# Altium schematic sheet Verwarmingselement.SchDoc
size A; SheetNumber: 3; SheetTotal: 5
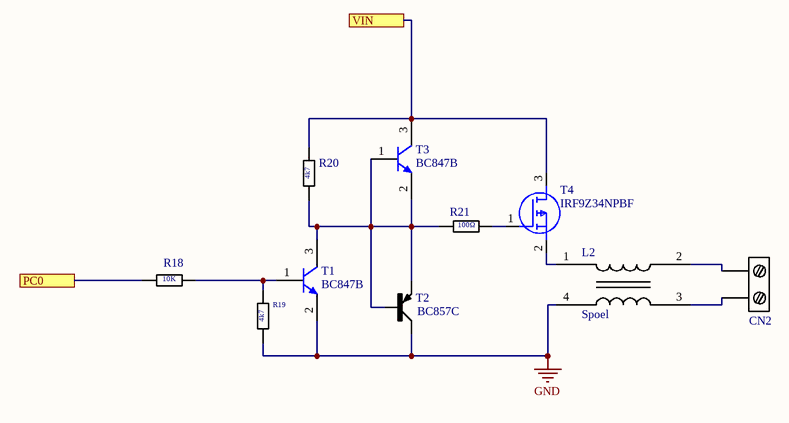
[diagram p0: Verwarmingselement.SchDoc]

## Parts
CN2  (no value)  [K1,K2,K3,K8 Printkroonsteen]
L2  Spoel  [CM2545x171B-10]
R18  10K  [Resistor]
R19  4k7  [Resistor]
R20  4k7  [Resistor]
R21  100Ω  [Resistor]
T1  BC847B  [bc847b]
T2  BC857C  [BC557C]
T3  BC847B  [bc847b]
T4  IRF9Z34NPBF  [TO254P469X1042X1967-3P]

## Ports
PC0 (see Soldeer Station[3A]), VIN (see Batterij[3C])

## Nets
GND: L2.4 R19.1 T1.2(E) T2.C
PC0: R18.1 ; port PC0
VIN: R20.2 T3.3(C) T4.3(D) ; port VIN
NetCN2_1: CN2.1 L2.2
NetCN2_2: CN2.2 L2.3
NetL2_1: L2.1 T4.2(S)
NetR18_2: R18.2 R19.2 T1.1(B)
NetR20_1: R20.1 R21.1 T1.3(C) T2.B T2.E T3.1(B) T3.2(E)
NetR21_2: R21.2 T4.1(G)

## Library data of the parts
CN2 = K1,K2,K3,K8 Printkroonsteen: MF: TE Connectivity; MP: 282837-2; SnapEDA_Link: https://www.snapeda.com/parts/282837-2/TE+Connectivity+AMP+Connectors/view-part/?ref=snap; Price: None; Check_prices: https://www.snapeda.com/parts/282837-2/TE+Connectivity+AMP+Connectors/view-part/?ref=eda; Purchase-URL: https://pricing.snapeda.com/search/part/282837-2/?ref=eda; Value: *; Availability: In Stock; Package: None
L2 = Common Mode Smoorspoel: Lead Diameter: 0.9mm; Voltage Rating (DC): 300V; Current: 700mA; Inductance: 10mH; Lead/Base Style: Pin; DC Resistance (DCR): 100mR; Shielding: Unshielded; Number of Lines: 2; Packaging: Bulk; Max Operating Temperature: 120°C; Depth: 16mm; Width: 0.63inch; Radiation Hardening: No; Max DC Current: 700mA; Package Quantity: 1260; Height: 17.5mm; Current Rating: 700mA; Military Standard: Not; Lead Free: Lead Free; Orientation: Vertical; DC Current: 700mA; Termination: Radial; Insulation Resistance: 100MR; Length: 18mm; Mount: Through Hole; Lead Pitch: 13mm; Min Operating Temperature: -25°C; REACH SVHC: No SVHC
R18-R21 = Resistor: Manufacturer: Vishay Dale; Part Number: CRCW08050000Z0EA
T1 T3 = BC847B: NPN Silicon AF Transistor, 45 V VCEO, 100 mA IC, SOT23, Reel, Green; Manufacturer: Infineon; VEBO (max): 6Â V; ICBO (max): 15Â nA; VCBO (max): 50Â V; IBM (max): 200Â mA; Green: TRUE; Ptot (max): 330Â mW; fT (typ): 250Â MHz; IC (max): 100Â mA; VCEO (max): 45Â V; PackageDescription: 3-Pin Small Outline Transistor Package, 1.3 x 2.9 mm Body, 0.95 mm Pitch; ComponentLink3URL: http://www.infineon.com/dgdl/SOT23-Package_Overview.pdf?folderId=db3a30431936bc4b0119532290053c66&fileId=db3a30431936bc4b0119533468123c85; PackageVersion: Apr-08; Packing: Reel; ComponentLink3Description: Package Specification; ComponentLink2URL: http://www.infineon.com/dgdl/bc847series_bc848series_bc849series_bc850series.pdf?folderId=db3a304314dca389011541d30fa21656&fileId=db3a304314dca389011541d4630a1657; ComponentLink1URL: http://www.infineon.com/; ComponentLink2Description: Datasheet; Polarity: NPN; Mounting Technology: Surface Mount; PackageReference: SOT23; ICM (max): 200Â mA; ComponentLink1Description: Manufacturer URL; PartNumber: BC847B
T2 = BC557C: MP: BC557; MF: ON; Availability: In Stock; Package: E-PKG AXIAL-LEADED-2 ON Semiconductor; Value: *; Check_prices: https://www.snapeda.com/parts/BC557/Onsemi/view-part/?ref=eda; SnapEDA_Link: https://www.snapeda.com/parts/BC557/Onsemi/view-part/?ref=snap; Price: None
T4 = IRF9Z34NPBF: MOSFET (P-Channel); Manufacturer_Name: Infineon; Datasheet Link: https://www.infineon.com/dgdl/irf9z34npbf.pdf?fileId=5546d462533600a40153561220af1ddd; Height: 4.69mm; Manufacturer_Part_Number: IRF9Z34NPBF; Mouser Part Number: 942-IRF9Z34NPBF; Mouser Price/Stock: https://www.mouser.co.uk/ProductDetail/Infineon-Technologies/IRF9Z34NPBF?qs=9%252BKlkBgLFf16a%2FvlD%252BMCtQ%3D%3D; Arrow Part Number: IRF9Z34NPBF; Arrow Price/Stock: https://www.arrow.com/en/products/irf9z34npbf/infineon-technologies-ag?region=europe